# Altium project 2026_RoboSumo_Motherboard.PrjPcb
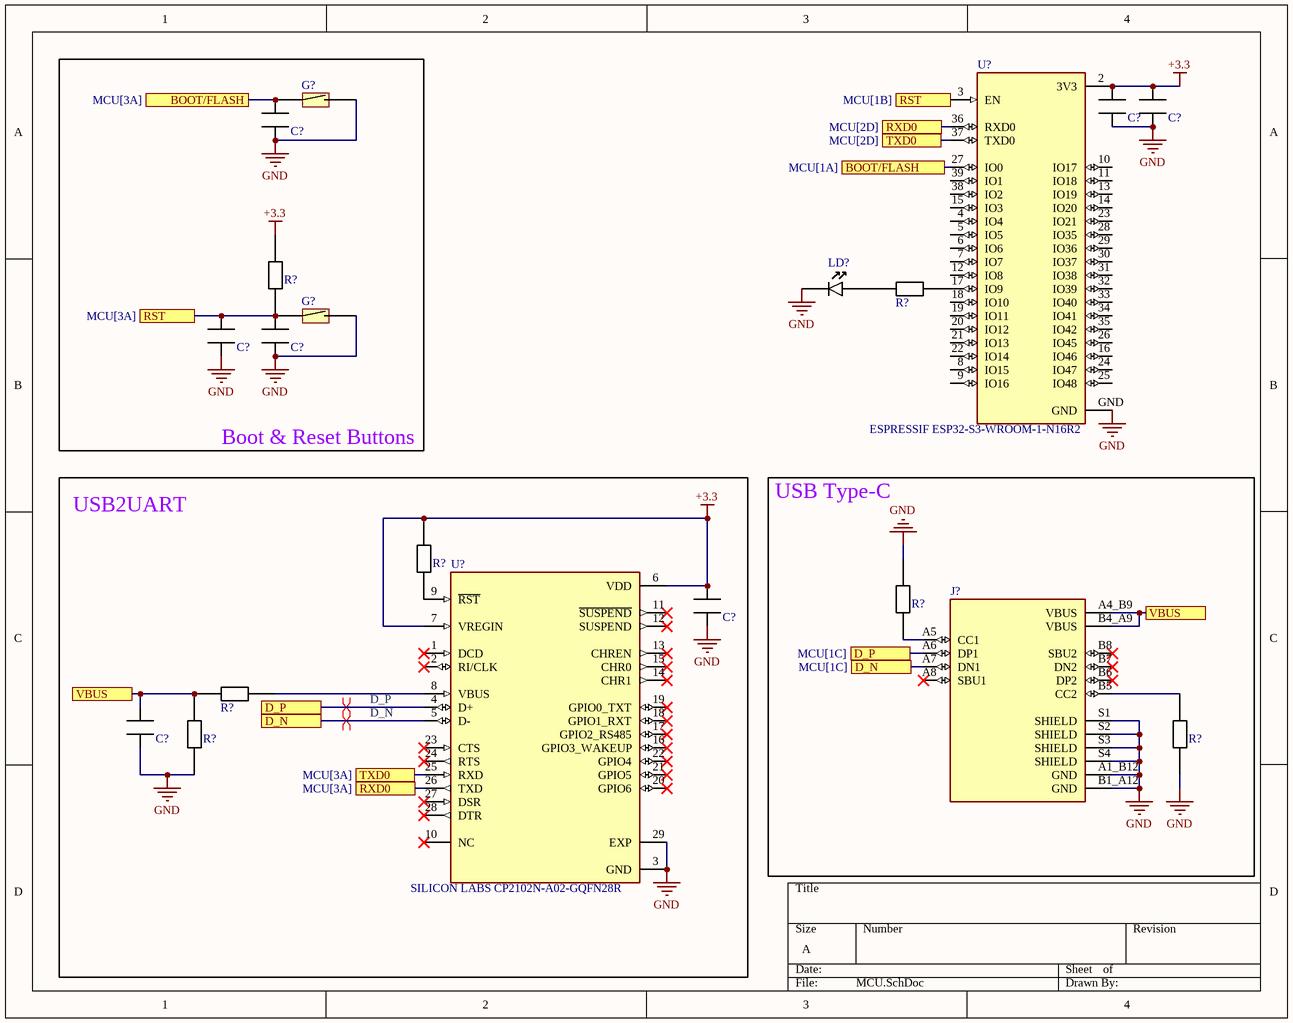
[diagram p0: MCU.SchDoc]
2 sheets, 48 parts. Net scope: flat (ports and power ports of the same name join across sheets).
Sheets:
  MCU.SchDoc
  Power.SchDoc

## Sheet MCU.SchDoc
size A; SheetNumber: 1; SheetTotal: 2

### Parts
(Parts that share a designator on the sheet are numbered #1, #2 ... from top to bottom, then left to right.)
C?#1  100nF  [CAP_0805]  (value not drawn)
C?#2  10uF  [CAP_0805]  (value not drawn)
C?#3  100nF  [CAP_0805]  (value not drawn)
C?#4  1uF  [CAP_0805]  (value not drawn)
C?#5  100nF  [CAP_0805]  (value not drawn)
C?#6  10uF  [CAP_0805]  (value not drawn)
C?#7  1uF  [CAP_0805]  (value not drawn)
G?#1  Push_Button  [Push_Button]  (value not drawn)
G?#2  Push_Button  [Push_Button]  (value not drawn)
J?  SHOU HAN TYPE-C 16PIN 2MD(073)  [HRO_TYPE-C-31-M-12]  (value not drawn)
LD?  LED_0805  [LED_0805]  (value not drawn)
R?#1  10k  [RES_0805]  (value not drawn)
R?#2  *  [RES_0805]  (value not drawn)
R?#3  1k  [RES_0805]  (value not drawn)
R?#4  *  [RES_0805]  (value not drawn)
R?#5  22.1k  [RES_0805]  (value not drawn)
R?#6  47.5k  [RES_0805]  (value not drawn)
R?#7  *  [RES_0805]  (value not drawn)
U?#1  ESPRESSIF ESP32-S3-WROOM-1-N16R2  [XCVR_ESP32-S3-WROOM-1-N16R2]
U?#2  SILICON LABS CP2102N-A02-GQFN28R  [IC_CP2102N-A02-GQFN28R]

### Blocks framed on the sheet
Boot & Reset Buttons: C?#3-C?#5 G?#1 G?#2 R?#1
USB2UART: C?#6 C?#7 R?#3 R?#5 R?#6 U?#2
USB Type-C: J? R?#4 R?#7

### Ports
BOOT/FLASH (see MCU[1A]), BOOT/FLASH (see MCU[3A]), D_N (see MCU[1C]), D_N (see MCU[3C]), D_P (see MCU[1C]), D_P (see MCU[3C]), RST (see MCU[1B]), RST (see MCU[3A]), RXD0 (see MCU[2D]), RXD0 (see MCU[3A]), TXD0 (see MCU[2D]), TXD0 (see MCU[3A]), VBUS (see MCU[1C]), VBUS (see MCU[4C])

### Nets
+3.3: C?#1.2 C?#2.2 C?#6.2 R?#1.2 R?#3.2 U?#1.2(3V3) U?#2.6(VDD) U?#2.7(VREGIN)
GND: C?#1.1 C?#2.1 C?#3.1 C?#4.1 C?#5.1 C?#6.1 C?#7.1 G?#1.1 G?#2.1 J?.A1_B12(GND) J?.B1_A12(GND) J?.S1(SHIELD) J?.S2(SHIELD) J?.S3(SHIELD) J?.S4(SHIELD) LD?.1 R?#4.2 R?#6.2 R?#7.1 U?#1.GND U?#2.3(GND) U?#2.29(EXP)
D_N: J?.A7(DN1) U?#2.5(D-) ; port D_N
D_P: J?.A6(DP1) U?#2.4(D+) ; port D_P
NetC?#3_2: C?#3.2 G?#1.2 U?#1.27(IO0) ; port BOOT/FLASH
NetC?#4_2: C?#4.2 C?#5.2 G?#2.2 R?#1.1 U?#1.3(EN) ; port RST
NetC?#7_2: C?#7.2 J?.A4_B9(VBUS) J?.B4_A9(VBUS) R?#5.2 R?#6.1 ; port VBUS
NetJ?_A5: J?.A5(CC1) R?#4.1
NetJ?_B5: J?.B5(CC2) R?#7.2
NetLD?_2: LD?.2 R?#2.1
NetR?#2_2: R?#2.2 U?#1.17(IO9)
NetR?#3_1: R?#3.1 U?#2.9(~{RST})
NetR?#5_1: R?#5.1 U?#2.8(VBUS)
NetU?#1_36: U?#1.36(RXD0) U?#2.26(TXD) ; port RXD0
NetU?#1_37: U?#1.37(TXD0) U?#2.25(RXD) ; port TXD0

Not connected (* = marked no-connect by the designer): J? A8(SBU1)* B6(DP2)* B7(DN2)* B8(SBU2)*; U?#1 4(IO4) 5(IO5) 6(IO6) 7(IO7) 8(IO15) 9(IO16) 10(IO17) 11(IO18) 12(IO8) 13(IO19) 14(IO20) 15(IO3) 16(IO46) 18(IO10) 19(IO11) 20(IO12) 21(IO13) 22(IO14) 23(IO21) 24(IO47) 25(IO48) 26(IO45) 28(IO35) 29(IO36) 30(IO37) 31(IO38) 32(IO39) 33(IO40) 34(IO41) 35(IO42) 38(IO2) 39(IO1); U?#2 1(DCD)* 2(RI/CLK)* 10(NC)* 11(~{SUSPEND})* 12(SUSPEND)* 13(CHREN)* 14(CHR1)* 15(CHR0)* 16(GPIO3_WAKEUP)* 17(GPIO2_RS485)* 18(GPIO1_RXT)* 19(GPIO0_TXT)* 20(GPIO6)* 21(GPIO5)* 22(GPIO4)* 23(CTS)* 24(RTS)* 27(DSR)* 28(DTR)*

### Layout directives
differential pair: D_N, D_P

### Library data of the parts
C?#1-C?#7 = CAP_0805: note: any manufacturer
  C?#1 C?#3 C?#5: val: 100nF
  C?#2 C?#6: val: 10uF
  C?#4 C?#7: val: 1uF
G?#1 G?#2 = Push_Button: Push Button; note: any manufacturer; val: 3x6x4.3MM 2PIN SMT Tactile Tact Push Button button SPST-NO; sample link: https://www.lcsc.com/product-detail/C42420255.html
J? = TYPE-C-31-M-12: USB-C (USB TYPE-C) Receptacle Connector 16 Position Surface Mount, Right Angle; val: SHOU HAN TYPE-C 16PIN 2MD(073); note: *; sample link: https://www.lcsc.com/product-detail/C2765186.html?s_z=n_type%2520C
R?#1-R?#7 = RES_0805: note: any manufacturer
  R?#1: val: 10k
  R?#2 R?#4 R?#7: val: *
  R?#3: val: 1k
  R?#5: val: 22.1k
  R?#6: val: 47.5k
U?#1 = ESP32-S3-WROOM-1-N16R2: 2.4GHz ESP32-S3 On-board PCB Antenna -103.5dBm SMD,25.5x18mm RF Transceiver Modules and Modems RoHS; val: ESPRESSIF ESP32-S3-WROOM-1-N16R2; note: *; sample link: https://www.lcsc.com/product-detail/C2913205.html?s_z=n_esp32-s3
U?#2 = CP2102N-A02-GQFN28R: USB to UART USB 2.0 QFN-28-EP(5x5) Interface Controllers RoHS; val: SILICON LABS CP2102N-A02-GQFN28R; note: *; sample link: https://www.lcsc.com/product-detail/C964632.html?s_z=n_CP2102N-A02-GQFN28

## Sheet Power.SchDoc
size A; SheetNumber: 2; SheetTotal: 4
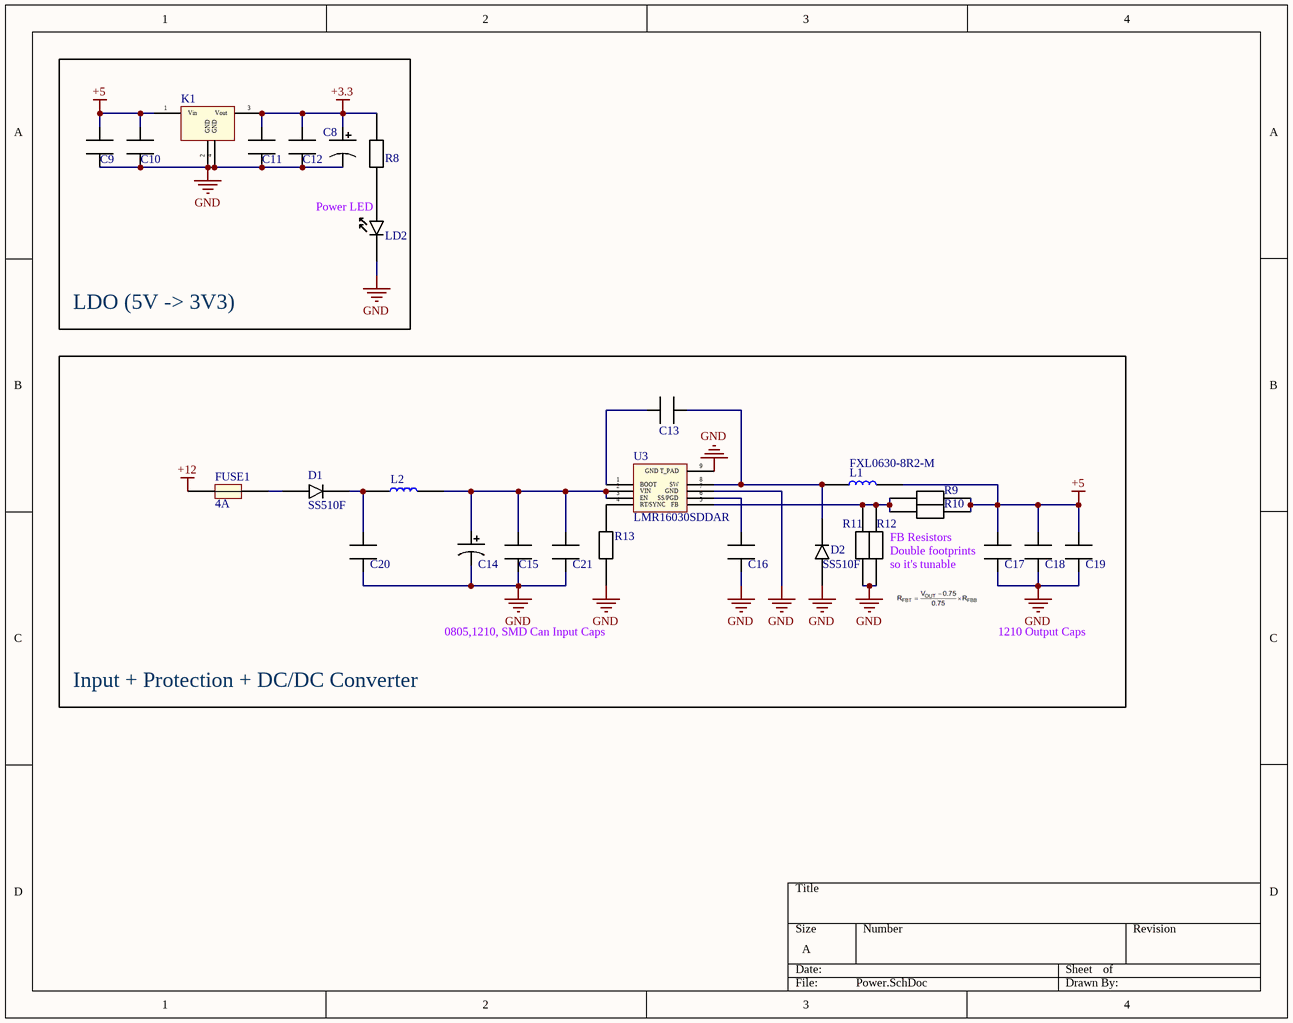
[diagram p1: Power.SchDoc]

### Parts
C8  10uf  [CAP_CAN_D5MM]  (value not drawn)
C9  1uF  [CAP_1206]  (value not drawn)
C10  100nF  [CAP_0805]  (value not drawn)
C11  100nF  [CAP_0805]  (value not drawn)
C12  1uF  [CAP_1206]  (value not drawn)
C13  100nF 50V  [CAP_0805]  (value not drawn)
C14  47uf 100v  [CAP_CAN_D10mm]  (value not drawn)
C15  10uF 100V  [CAP_1210]  (value not drawn)
C16  100nF 50V  [CAP_0805]  (value not drawn)
C17  CS3225X7R476K160NRL  [CAP_1210]  (value not drawn)
C18  CS3225X7R476K160NRL  [CAP_1210]  (value not drawn)
C19  CS3225X7R476K160NRL  [CAP_1210]  (value not drawn)
C20  100nF 100V  [CAP_0805]  (value not drawn)
C21  100nF 100V  [CAP_0805]  (value not drawn)
D1  SS510F  [SMAF]
D2  SS510F  [SMAF]
FUSE1  4A  [FUSE_1206]
K1  MIC39100-3.3WS  [SOT223-4]  (value not drawn)
L1  FXL0630-8R2-M  [IND_FXL06]
L2  10uH 1.2A  [IND_1210]  (value not drawn)
LD2  LED_0805  [LED_0805]  (value not drawn)
R8  10k  [RES_0805]  (value not drawn)
R9  10k  [RES_0805]  (value not drawn)
R10  NC  [RES_0805]  (value not drawn)
R11  2k  [RES_0805]  (value not drawn)
R12  15k  [RES_0805]  (value not drawn)
R13  10k  [RES_0805]  (value not drawn)
U3  LMR16030SDDAR  [SOIC8_T]

### Blocks framed on the sheet
LDO (5V -> 3V3): C8-C12 K1 LD2 R8
Input + Protection + DC/DC Converter: C13-C21 D1 D2 FUSE1 L1 L2 R9-R13 U3

### Nets
+3.3: C8.1 C11.2 C12.2 K1.3(Vout) R8.2
+5: C9.2 C10.2 C17.2 C18.2 C19.2 K1.1(Vin) L1.2 R9.2 R10.2
+12: FUSE1.1
GND: C8.2 C9.1 C10.1 C11.1 C12.1 C14.2 C15.1 C16.1 C17.1 C18.1 C19.1 C20.1 C21.1 D2.2 K1.2(GND) K1.4(GND) LD2.1 R11.2 R12.2 R13.1 U3.7(GND) U3.9(GND_T_PAD)
NetC13_1: C13.1 U3.1(BOOT)
NetC13_2: C13.2 D2.1 L1.1 U3.8(SW)
NetC14_1: C14.1 C15.2 C21.2 L2.2 U3.2(VIN) U3.3(EN)
NetC16_2: C16.2 U3.6(SS/PGD)
NetC20_2: C20.2 D1.1 L2.1
NetD1_2: D1.2 FUSE1.2
NetLD2_2: LD2.2 R8.1
NetR9_1: R9.1 R10.1 R11.1 R12.1 U3.5(FB)
NetR13_2: R13.2 U3.4(RT/SYNC)

### Notes on the sheet
- (near LD2) Power LED
- FB Resistors
- (near C17) Double footprints
- so it's tunable
- 0805,1210, SMD Can Input Caps
- 1210 Output Caps

### Library data of the parts
C8 = CAP_CAN_D5mm: SMD Can Capacitor; 5mm Diameter; note: any manufacturer; val: 10uf; sample link: https://www.lcsc.com/product-detail/C3357.html?s_z=n_10uF%2520SMD%2520Can%2520Capacitor%2520D5%2520RVT
C9 C12 = CAP_1206: note: any manufacturer; val: 1uF
C10 C11 C13 C16 C20 C21 = CAP_0805: note: any manufacturer
  C10 C11: val: 100nF
  C13 C16: val: 100nF 50V
  C20 C21: val: 100nF 100V
C14 = CAP_CAN_D10mm: SMD Can Capacitor; 10mm Diameter; note: Original; val: 47uf 100v; sample link: https://www.lcsc.com/product-detail/Aluminum-Electrolytic-span-style-background-color-ff0-Capacitors-span-SMD_ROQANG-RVT2A470M1010_C335988.html
C15 C17-C19 = CAP_1210: note: any manufacturer
  C15: val: 10uF 100V
  C17-C19: val: CS3225X7R476K160NRL; sample link: https://www.lcsc.com/product-detail/Multilayer-Ceramic-Capacitors-MLCC-SMD-SMT_Samwha-Capacitor-CS3225X7R476K160NRL_C5440143.html
D1 D2 = SS510F: 100V 850mV@5A 5A SMAF Schottky Diodes ROHS; note: any manufacturer; val: SS510F; sample link: https://www.lcsc.com/product-detail/Schottky-Diodes_XUMAO-SS510F_C22466253.html
FUSE1 = Fuse_1206: val: 4A; sample link: https://item.taobao.com/item.htm?abbucket=8&id=562837668942&ns=1&spm=a230r.1.14.1.30d440c1oWmyxt; note: https://item.taobao.com/item.htm?abbucket=8&id=562837668942&ns=1&spm=a230r.1.14.1.30d440c1oWmyxt
K1 = MIC39100_SOT223: LDO; / 2.25V -> 16V; / 1A Max; / Fixed Output - 1.8V, 2.5V, 3.3V, 5V; note: Original; val: MIC39100-3.3WS; sample link: https://www.lcsc.com/product-detail/Linear-Voltage-Regulators-span-style-background-color-ff0-LDO-span_MaxLinear-SPX3940AM3-L-3-3-TR_C48252.html
L1 = IND_FXL06: Precision Wire Wound Inductor, 2-Leads, Body 4,50x4,00mm, IPC Medium Density; note: original; sample link: https://www.lcsc.com/product-detail/span-style-background-color-ff0-Power-span-Inductors_cjiang-Changjiang-Microelectronics-Tech-FXL0630-8R2-M_C167222.html; val: FXL0630-8R2-M
L2 = IND_1210_Choke: Precision Wire Wound Inductor, 2-Leads, Body 4,50x4,00mm, IPC Medium Density; val: TDK TFM322512ALMA100MTAA; note: Original; sample link: https://www.lcsc.com/product-detail/C2047632.html
R8-R13 = RES_0805: note: any manufacturer
  R8 R9 R13: val: 10k
  R10: val: NC
  R11: val: 2k
  R12: val: 15k
U3 = TI LMR16030SDDAR: 60V 3A Step-Down Converter / 2.5MHz Buck Adjustable 1 SO-8-EP Voltage Regulators - DC DC Switching Regulators RoHS; note: original; val: LMR16030SDDAR; sample link: https://www.lcsc.com/product-detail/DC-DC-Converters_Texas-Instruments-LMR16030SDDAR_C136648.html

## Nets that join several sheets
+3.3: MCU (8 pins), Power (5 pins)
GND: MCU (22 pins), Power (22 pins)